# Altium schematic sheet Bison-Board-PCB-V1.4.SchDoc: Bison-Board
size A4; DrawnBy: mzy2364; Revision: V1.4
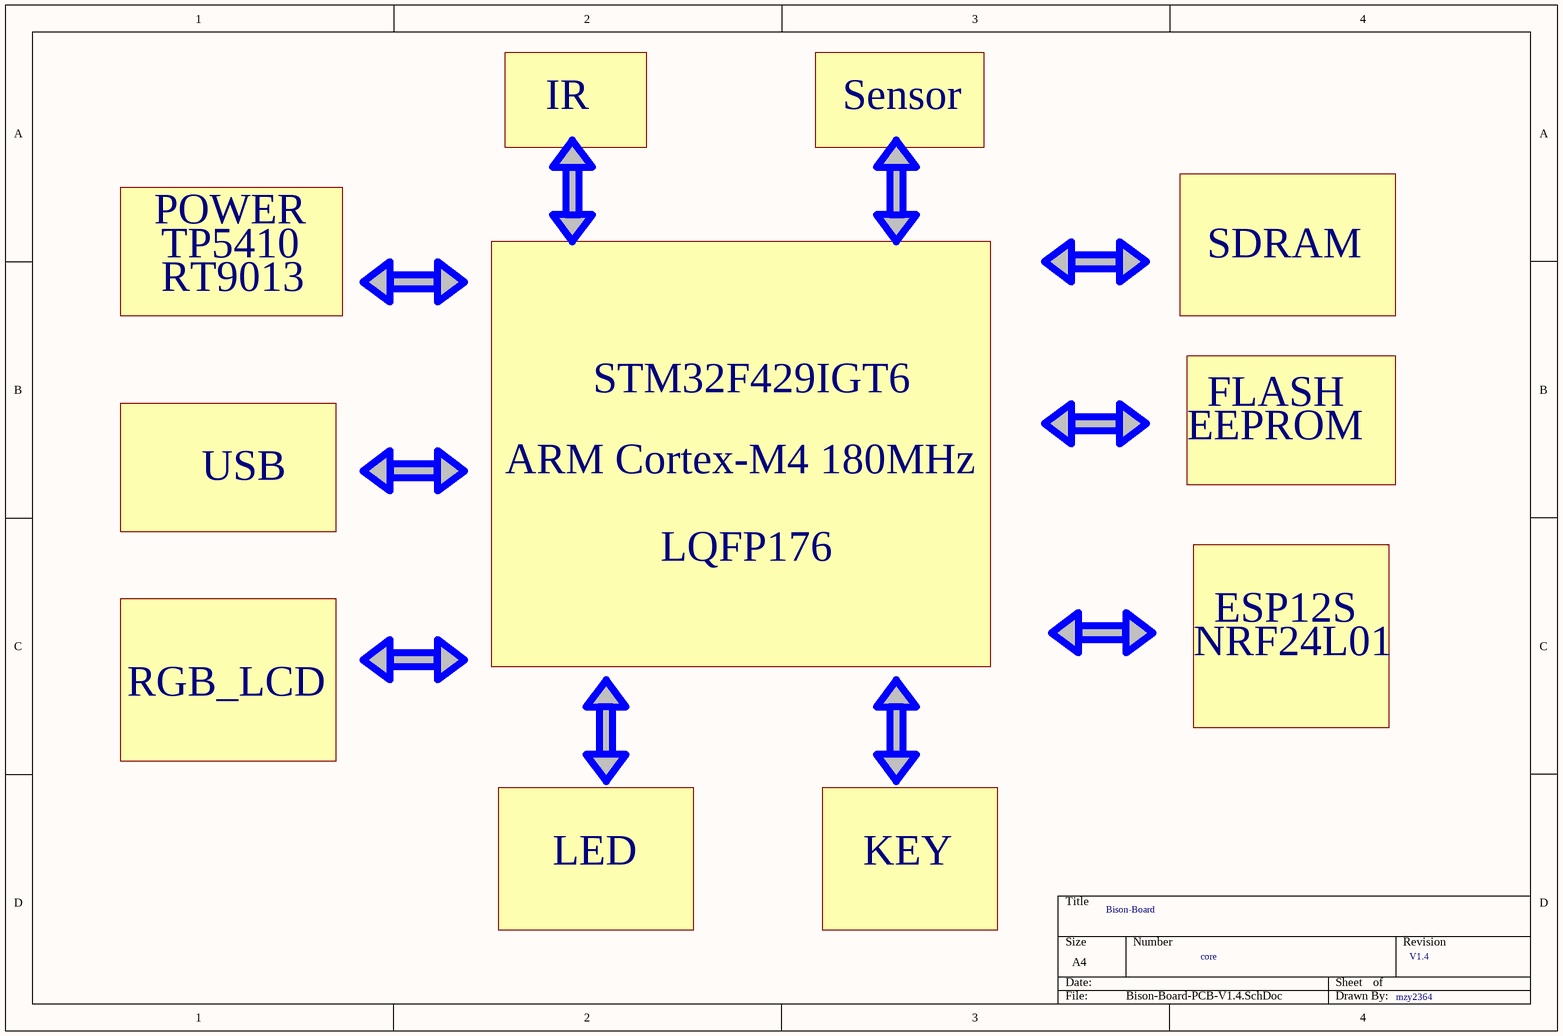
[diagram p0: Bison-Board-PCB-V1.4.SchDoc]

## Notes on the sheet
- IR
- Sensor
- POWER
- TP5410
- RT9013
- SDRAM
- STM32F429IGT6
- EEPROM
- FLASH
- USB
- ARM Cortex-M4 180MHz
- LQFP176
- ESP12S
- RGB_LCD
- NRF24L01
- LED
- KEY
- core